# Altium schematic sheet PCB_Steering_Wheel_REDO.SchDoc
size A; SheetNumber: 1; SheetTotal: 1
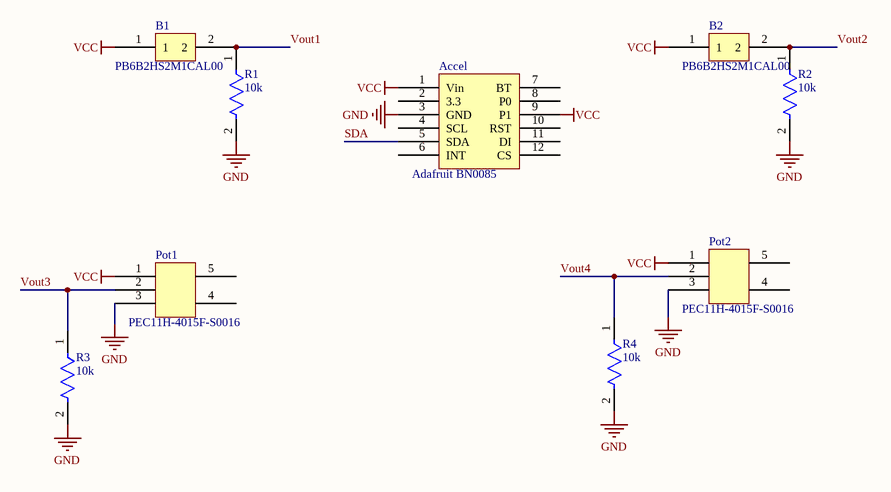
[diagram p0: PCB_Steering_Wheel_REDO.SchDoc]

## Parts
Accel  Adafruit BN0085  [Adafruit BN0085-Footprint-1]
B1  PB6B2HS2M1CAL00  [PB6B2HS2M1CAL00-Footprint-1]
B2  PB6B2HS2M1CAL00  [PB6B2HS2M1CAL00-Footprint-1]
Pot1  PEC11H-4015F-S0016  [PEC11H-4015F-S0016-Footprint-1]
Pot2  PEC11H-4015F-S0016  [PEC11H-4015F-S0016-Footprint-1]
R1  10k  [FP-H45K0BAA-MFG]
R2  10k  [FP-H45K0BAA-MFG]
R3  10k  [FP-H45K0BAA-MFG]
R4  10k  [FP-H45K0BAA-MFG]

## Nets
GND: Accel.3(GND) Pot1.3 Pot2.3 R1.2 R2.2 R3.2 R4.2
VCC: Accel.1(Vin) Accel.9(P1) B1.1 B2.1 Pot1.1 Pot2.1
SDA: Accel.5(SDA)
Vout1: B1.2 R1.1
Vout2: B2.2 R2.1
Vout3: Pot1.2 R3.1
Vout4: Pot2.2 R4.1

Not connected (* = marked no-connect by the designer): Accel 2(3.3) 4(SCL) 6(INT) 7(BT) 8(P0) 10(RST) 11(DI) 12(CS); Pot1 4 5; Pot2 4 5

## Library data of the parts
Accel = CMP-010-00024-4: 9DoF Accel/Gyro
B1 B2 = CMP-00028-00007-7: Standard PB6 Black Panel Mount Front Pushbutton Switch 125mA AC 200mA DC 125V -30C~85C
Pot1 Pot2 = CMP-00028-00009-3: INCREMENTAL ENCODER, 2CH, 60 RPM, 16 PPR; Encoder Technology: Mechanical; Type: Incremental;; Mounting Technology: Through Hole,Panel,PCB
R1-R4 = CMP-03212-000004-1: RES 5.00K OHM 1/2W 0.1% AXIAL; Number of Resistors: 1; Power Rating: 500mW; Resistance: 5kR; Temperature Coefficient: 5ppm/°C; Voltage Rating: 350V; Lead Diameter: 0.6mm; Resistor Type: Thin Film; Mount: Axial; Contact Plating: Tin; Weight: 0.01411oz; Packaging: Bulk; Min Operating Temperature: -55°C; Package Quantity: 250; Case/Package: Axial; Number of Terminations: 2; Termination: Axial; Radiation Hardening: No; Max Operating Temperature: 155°C; RoHS Compliant: Yes; Series: Holco, Holsworthy; ELV: Compliant; Tolerance: 0.1%; Diameter: 3.7mm; Length: 10mm; Max Power Dissipation: 500mW